# Altium project Motor Driver.PrjPcb
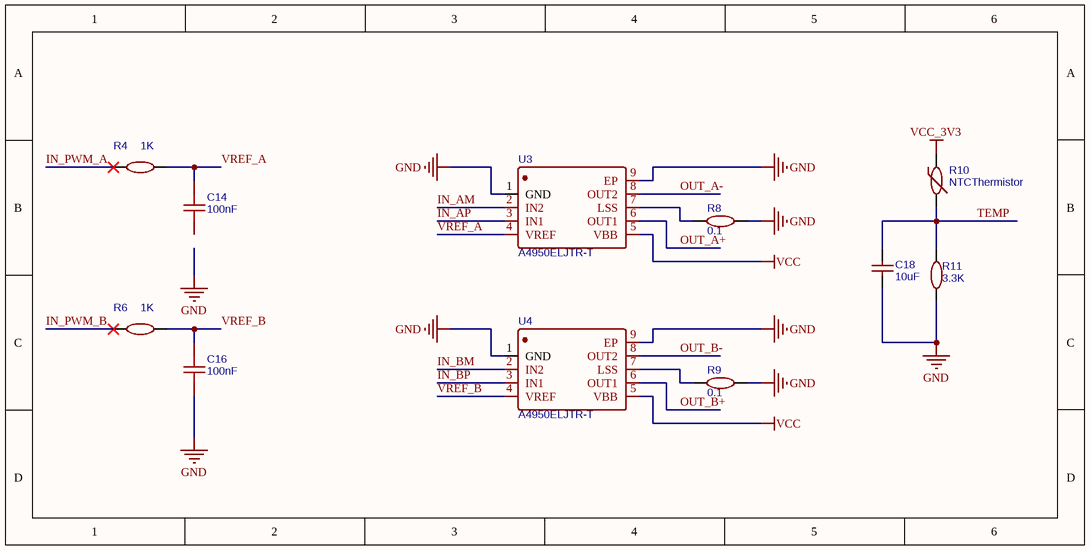
[diagram p0: Drive.SchDoc]
3 sheets, 26 parts. Net scope: global (net labels, ports and power ports of the same name join across sheets).
Board file: Motor Driver.PcbDoc
Sheets:
  Drive.SchDoc
  MCU.SchDoc
  Port.SchDoc

## Sheet Drive.SchDoc
size 203 x 101 mm; SheetNumber: 2; SheetTotal: 5

### Parts
C14  100nF  [C0603]
C16  100nF  [C0603]
C18  10uF  [C1206]
R4  1K  [R0603]
R6  1K  [R0603]
R8  0.1  [R1206]
R9  0.1  [R1206]
R10  NTCThermistor  [R0402]
R11  3.3K  [R0603_NEW]
U3  A4950ELJTR-T  [SOIC-8_L4.9-W3.9-P1.27-LS6.0-BL-EP]
U4  A4950ELJTR-T  [SOIC-8_L4.9-W3.9-P1.27-LS6.0-BL-EP]

### Nets
GND: C16.1 C18.1 R8.2 R9.2 R11.1 U3.1(GND) U3.9(EP) U4.1(GND) U4.9(EP)
VCC: U3.5(VBB) U4.5(VBB)
VCC_3V3: R10.1
IN_AM: U3.2(IN2)
IN_AP: U3.3(IN1)
IN_BM: U4.2(IN2)
IN_BP: U4.3(IN1)
IN_PWM_A: R4.1
IN_PWM_B: R6.1
OUT_A+: U3.6(OUT1)
OUT_A-: U3.8(OUT2)
OUT_B+: U4.6(OUT1)
OUT_B-: U4.8(OUT2)
TEMP: C18.2 R10.2 R11.2
VREF_A: C14.2 R4.2 U3.4(VREF)
VREF_B: C16.2 R6.2 U4.4(VREF)
NetR8_1: R8.1 U3.7(LSS)
NetR9_1: R9.1 U4.7(LSS)

Not connected (* = marked no-connect by the designer): C14 1

### Library data of the parts
C14 C16 = 100nF: BOM_Manufacturer: SAMSUNG; BOM_Manufacturer Part: CL10B104KB8NNNC; nameAlias: Capacitance; BOM_Supplier: LCSC; BOM_Supplier Part: C1591; BOM_JLCPCB Part Class: Extended Part; spicePre: C; spiceSymbolName: CL10B104KB8NNNC
C18 = 10uF: BOM_Manufacturer Part: CL31A106KBHNNNE; BOM_Manufacturer: SAMSUNG; nameAlias: Capacitance; BOM_Supplier: LCSC; BOM_Supplier Part: C13585; BOM_JLCPCB Part Class: Basic Part; spicePre: C; spiceSymbolName: CL31A106KBHNNNE
R4 R6 = 1K: BOM_Manufacturer: UniOhm; BOM_Manufacturer Part: 0603WAF1001T5E; nameAlias: Resistance (Ohms); BOM_Supplier: LCSC; BOM_Supplier Part: C21190; BOM_JLCPCB Part Class: Basic Part; spicePre: R; spiceSymbolName: 0603WAF1001T5E
R8 R9 = 0.1: BOM_Manufacturer: UniOhm; BOM_Manufacturer Part: 1206W4F100LT5E; nameAlias: Resistance (Ohms); BOM_Supplier: LCSC; BOM_Supplier Part: C25334; BOM_JLCPCB Part Class: Basic Part; spicePre: R; spiceSymbolName: 1206W4F100LT5E
R10 = NTCThermistor: BOM_Manufacturer: MuRata; BOM_Manufacturer Part: NCP15XH103F03RC; nameAlias: Value; BOM_Supplier: LCSC; BOM_Supplier Part: C77131; BOM_JLCPCB Part Class: Extended Part; spicePre: R; spiceSymbolName: NCP15XH103F03RC
R11 = 3.3K: BOM_Manufacturer: UniOhm; BOM_Manufacturer Part: 0603WAF3301T5E; nameAlias: Resistance (Ohms); BOM_Supplier: LCSC; BOM_Supplier Part: C22978; BOM_JLCPCB Part Class: Basic Part; spicePre: R; spiceSymbolName: 0603WAF3301T5E
U3 U4 = A4950ELJTR-T: BOM_Manufacturer: ALLEGRO; BOM_Supplier: LCSC; BOM_Manufacturer Part: A4950ELJTR-T; BOM_Supplier Part: C82404; BOM_JLCPCB Part Class: Extended Part; spicePre: U; spiceSymbolName: A4950ELJTR-T

## Sheet MCU.SchDoc
size 228 x 127 mm; SheetNumber: 3; SheetTotal: 5
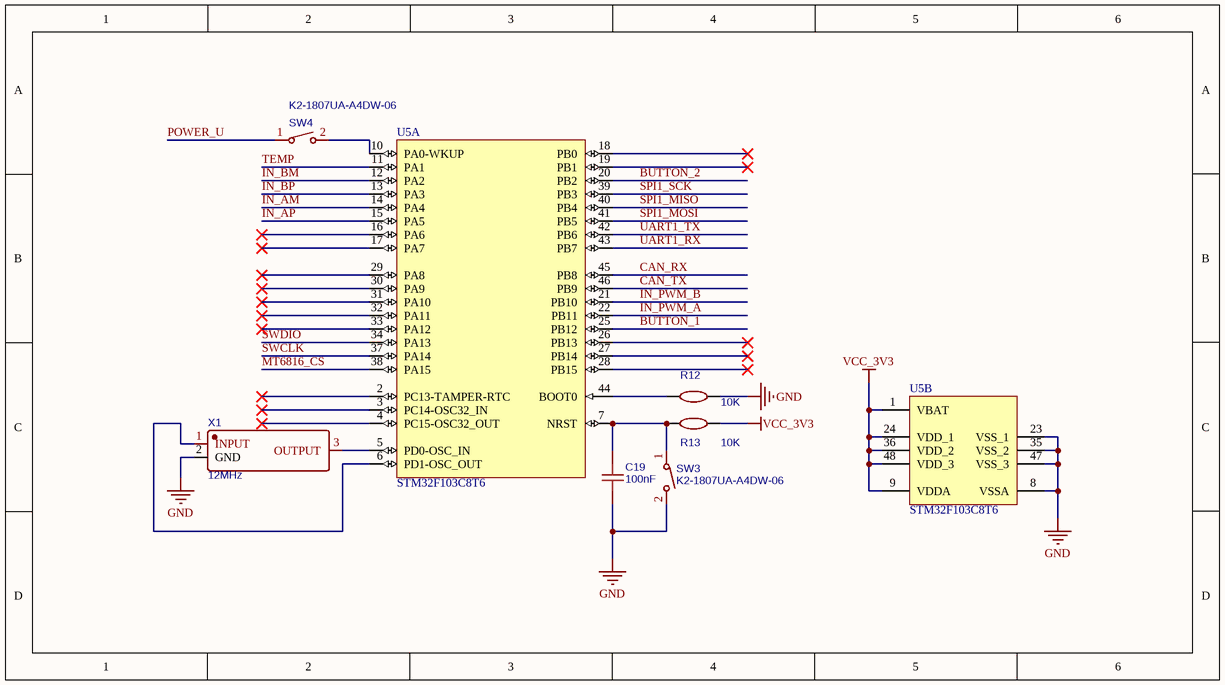
[diagram p1: MCU.SchDoc]

### Parts
C19  100nF  [C0603]
R12  10K  [R0603]
R13  10K  [R0603]
SW3  K2-1807UA-A4DW-06  [KEY-SMD_L4.0-W2.9-L]
SW4  K2-1807UA-A4DW-06  [KEY-SMD_L4.0-W2.9-L]
U5  STM32F103C8T6  [STM-LQFP48_L]  (parts A,B of 2)
X1  12MHz  [CRYSTAL-SMD_3P-L3.2-W1.3-P1.2-BL]

### Nets
GND: C19.1 R12.2 SW3.2 U5.8(VSSA) U5.23(VSS_1) U5.35(VSS_2) U5.47(VSS_3) X1.2(GND)
VCC_3V3: R13.2 U5.1(VBAT) U5.9(VDDA) U5.24(VDD_1) U5.36(VDD_2) U5.48(VDD_3)
BUTTON_1: U5.25(PB12)
BUTTON_2: U5.20(PB2)
CAN_RX: U5.45(PB8)
CAN_TX: U5.46(PB9)
IN_AM: U5.14(PA4)
IN_AP: U5.15(PA5)
IN_BM: U5.12(PA2)
IN_BP: U5.13(PA3)
IN_PWM_A: U5.22(PB11)
IN_PWM_B: U5.21(PB10)
MT6816_CS: U5.38(PA15)
POWER_U: SW4.1
SPI1_MISO: U5.40(PB4)
SPI1_MOSI: U5.41(PB5)
SPI1_SCK: U5.39(PB3)
SWCLK: U5.37(PA14)
SWDIO: U5.34(PA13)
TEMP: U5.11(PA1)
UART1_RX: U5.43(PB7)
UART1_TX: U5.42(PB6)
NetC19_2: C19.2 R13.1 SW3.1 U5.7(NRST)
NetR12_1: R12.1 U5.44(BOOT0)
NetSW4_2: SW4.2 U5.10(PA0-WKUP)
NetU5_5: U5.5(PD0-OSC_IN) X1.3(OUTPUT)
NetU5_6: U5.6(PD1-OSC_OUT) X1.1(INPUT)

Not connected (* = marked no-connect by the designer): U5 2(PC13-TAMPER-RTC)* 3(PC14-OSC32_IN)* 4(PC15-OSC32_OUT)* 16(PA6)* 17(PA7)* 18(PB0)* 19(PB1)* 26(PB13)* 27(PB14)* 28(PB15)* 29(PA8)* 30(PA9)* 31(PA10)* 32(PA11)* 33(PA12)*

### Library data of the parts
C19 = 100nF: as C14 on sheet Drive; BOM_Supplier: LCSC; BOM_Supplier Part: C1591; BOM_JLCPCB Part Class: Extended Part; spicePre: C; spiceSymbolName: CL10B104KB8NNNC
R12 R13 = 10K: BOM_Manufacturer: UniOhm; BOM_Manufacturer Part: 0603WAF1002T5E; nameAlias: Resistance (Ohms); BOM_Supplier: LCSC; BOM_Supplier Part: C25804; BOM_JLCPCB Part Class: Basic Part; spicePre: R; spiceSymbolName: 0603WAF1002T5E
SW3 SW4 = K2-1807UA-A4DW-06: BOM_Manufacturer: Korean Hroparts Elec; Contributor: LCSC; BOM_Supplier: LCSC; BOM_Supplier Part: C502307; BOM_Manufacturer Part: K2-1807UA-A4DW-06; BOM_JLCPCB Part Class: Extended Part; spicePre: S; spiceSymbolName: K2-1807UA-A4DW-06
U5 = CMP-0237-00215-3: ARM Cortex-M3 32-bit MCU, 64 KB Flash, 20 KB Internal RAM, 37 I/Os, 48-pin LQFP, -40 to 85 degC, Tray; Supply Voltage(Vcc) min (V): 2; Internal RAM Size (kB): 20; FLASH Size (Prog) (kB): 64; A/D Converter: 2x12-bit (10 Channel); I/Os (High Current): 37; Operating Frequency(F) (Processor speed) (MHz): 72; Core: ARM Cortex-M3; ComponentLink3Description: Package Specification; Mounting Technology: Surface Mount; PartNumber: STM32F103C8T6; PackageReference: LQFP48; Packing: Tray; ComponentLink3URL: http://www.st.com/st-web-ui/static/active/en/resource/technical/document/datasheet/DM00058181.pdf; DatasheetVersion: Rev. 16; ComponentLink1URL: http://www.st.com/web/en/home.html; PackageVersion: Rev. 6, 06/2013; ComponentLink2URL: http://www.st.com/st-web-ui/static/active/en/resource/technical/document/datasheet/CD00161566.pdf; ComponentLink1Description: Manufacturer URL; ComponentLink2Description: Datasheet; PackageDescription: 48-Pin Low Profile Quad Flat Package, 7 x 7 mm Body, 0.5 mm Pitch
X1 = 12MHz: BOM_Manufacturer: muRata(村田); BOM_Manufacturer Part: CSTNE12M0G52A000R0; nameAlias: Frequency; Contributor: LCSC; BOM_Supplier: LCSC; BOM_Supplier Part: C907957; BOM_JLCPCB Part Class: Extended Part; spicePre: X; spiceSymbolName: CSTNE12M0G52A000R0

## Sheet Port.SchDoc
size 127 x 177 mm; SheetNumber: 4; SheetTotal: 5
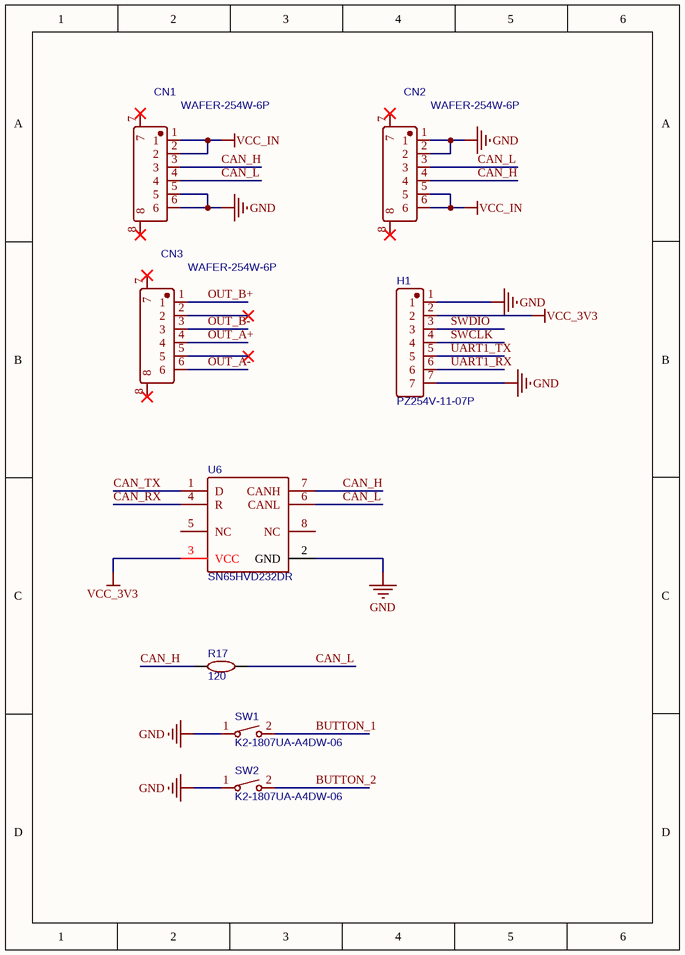
[diagram p2: Port.SchDoc]

### Parts
CN1  WAFER-254W-6P  [CONN-SMD_WAFER-254W-6P]
CN2  WAFER-254W-6P  [CONN-SMD_WAFER-254W-6P]
CN3  WAFER-254W-6P  [CONN-SMD_WAFER-254W-6P]
H1  PZ254V-11-07P  [HDR-TH_7P-P2.54-V-M]
R17  120  [R0603]
SW1  K2-1807UA-A4DW-06  [KEY-SMD_L4.0-W2.9-L]
SW2  K2-1807UA-A4DW-06  [KEY-SMD_L4.0-W2.9-L]
U6  SN65HVD232DR  [SOIC-8_L5.0-W4.0-P1.27-LS6.0-BL]

### Nets
GND: CN1.5 CN1.6 CN2.1 CN2.2 H1.1 H1.7 SW1.1 SW2.1 U6.2(GND)
VCC_3V3: H1.2 U6.3(VCC)
VCC_IN: CN1.1 CN1.2 CN2.5 CN2.6
BUTTON_1: SW1.2
BUTTON_2: SW2.2
CAN_H: CN1.3 CN2.4 R17.1 U6.7(CANH)
CAN_L: CN1.4 CN2.3 R17.2 U6.6(CANL)
CAN_RX: U6.4(R)
CAN_TX: U6.1(D)
OUT_A+: CN3.4
OUT_A-: CN3.6
OUT_B+: CN3.1
OUT_B-: CN3.3
SWCLK: H1.4
SWDIO: H1.3
UART1_RX: H1.6
UART1_TX: H1.5

Not connected (* = marked no-connect by the designer): CN1 7* 8*; CN2 7* 8*; CN3 2* 5* 7* 8*; U6 5(NC) 8(NC)

### Library data of the parts
CN1-CN3 = WAFER-254W-6P: BOM_Manufacturer: XUNPU(讯普); Contributor: LCSC; BOM_Supplier: LCSC; BOM_Supplier Part: C2856747; BOM_Manufacturer Part: WAFER-254W-6P; spicePre: C; spiceSymbolName: WAFER-254W-6P
H1 = PZ254V-11-07P: BOM_Manufacturer: XFCN; Contributor: LCSC; BOM_Supplier: LCSC; BOM_Supplier Part: C492406; BOM_Manufacturer Part: PZ254V-11-07P; BOM_JLCPCB Part Class: Extended Part; spicePre: H; spiceSymbolName: PZ254V-11-07P
R17 = 120: BOM_Manufacturer: UniOhm; BOM_Manufacturer Part: 0603WAF1200T5E; nameAlias: Resistance (Ohms); BOM_Supplier: LCSC; BOM_Supplier Part: C22787; BOM_JLCPCB Part Class: Basic Part; spicePre: R; spiceSymbolName: 0603WAF1200T5E
SW1 SW2 = K2-1807UA-A4DW-06: as SW3 on sheet MCU; BOM_Supplier: LCSC; BOM_Supplier Part: C502307; BOM_Manufacturer Part: K2-1807UA-A4DW-06; BOM_JLCPCB Part Class: Extended Part; spicePre: S; spiceSymbolName: K2-1807UA-A4DW-06
U6 = SN65HVD232DR: BOM_Manufacturer: TI; BOM_Supplier: LCSC; BOM_Manufacturer Part: SN65HVD232DR; BOM_Supplier Part: C30530; BOM_JLCPCB Part Class: Extended Part; spicePre: U; spiceSymbolName: SN65HVD232DR

## Nets that join several sheets
GND: Drive (9 pins), MCU (8 pins), Port (9 pins)
VCC_3V3: Drive (R10.1), MCU (6 pins), Port (H1.2 U6.3)
BUTTON_1: MCU (U5.25), Port (SW1.2)
BUTTON_2: MCU (U5.20), Port (SW2.2)
CAN_RX: MCU (U5.45), Port (U6.4)
CAN_TX: MCU (U5.46), Port (U6.1)
IN_AM: Drive (U3.2), MCU (U5.14)
IN_AP: Drive (U3.3), MCU (U5.15)
IN_BM: Drive (U4.2), MCU (U5.12)
IN_BP: Drive (U4.3), MCU (U5.13)
IN_PWM_A: Drive (R4.1), MCU (U5.22)
IN_PWM_B: Drive (R6.1), MCU (U5.21)
OUT_A+: Drive (U3.6), Port (CN3.4)
OUT_A-: Drive (U3.8), Port (CN3.6)
OUT_B+: Drive (U4.6), Port (CN3.1)
OUT_B-: Drive (U4.8), Port (CN3.3)
SWCLK: MCU (U5.37), Port (H1.4)
SWDIO: MCU (U5.34), Port (H1.3)
TEMP: Drive (C18.2 R10.2 R11.2), MCU (U5.11)
UART1_RX: MCU (U5.43), Port (H1.6)
UART1_TX: MCU (U5.42), Port (H1.5)